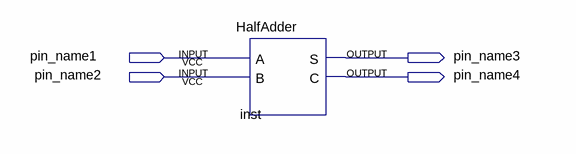
[diagram p0: schematic sheet]
// Quartus schematic HalfAdderSymbol.bdf as structural Verilog: 1 symbols, 4 pins
module HalfAdderSymbol (
  input  pin_name1,
  input  pin_name2,
  output pin_name3,
  output pin_name4
);

  HalfAdder inst (.A(pin_name1), .B(pin_name2), .S(pin_name3), .C(pin_name4));
endmodule
